# Altium schematic sheet 1XGSH00_MCU.SchDoc
size A3
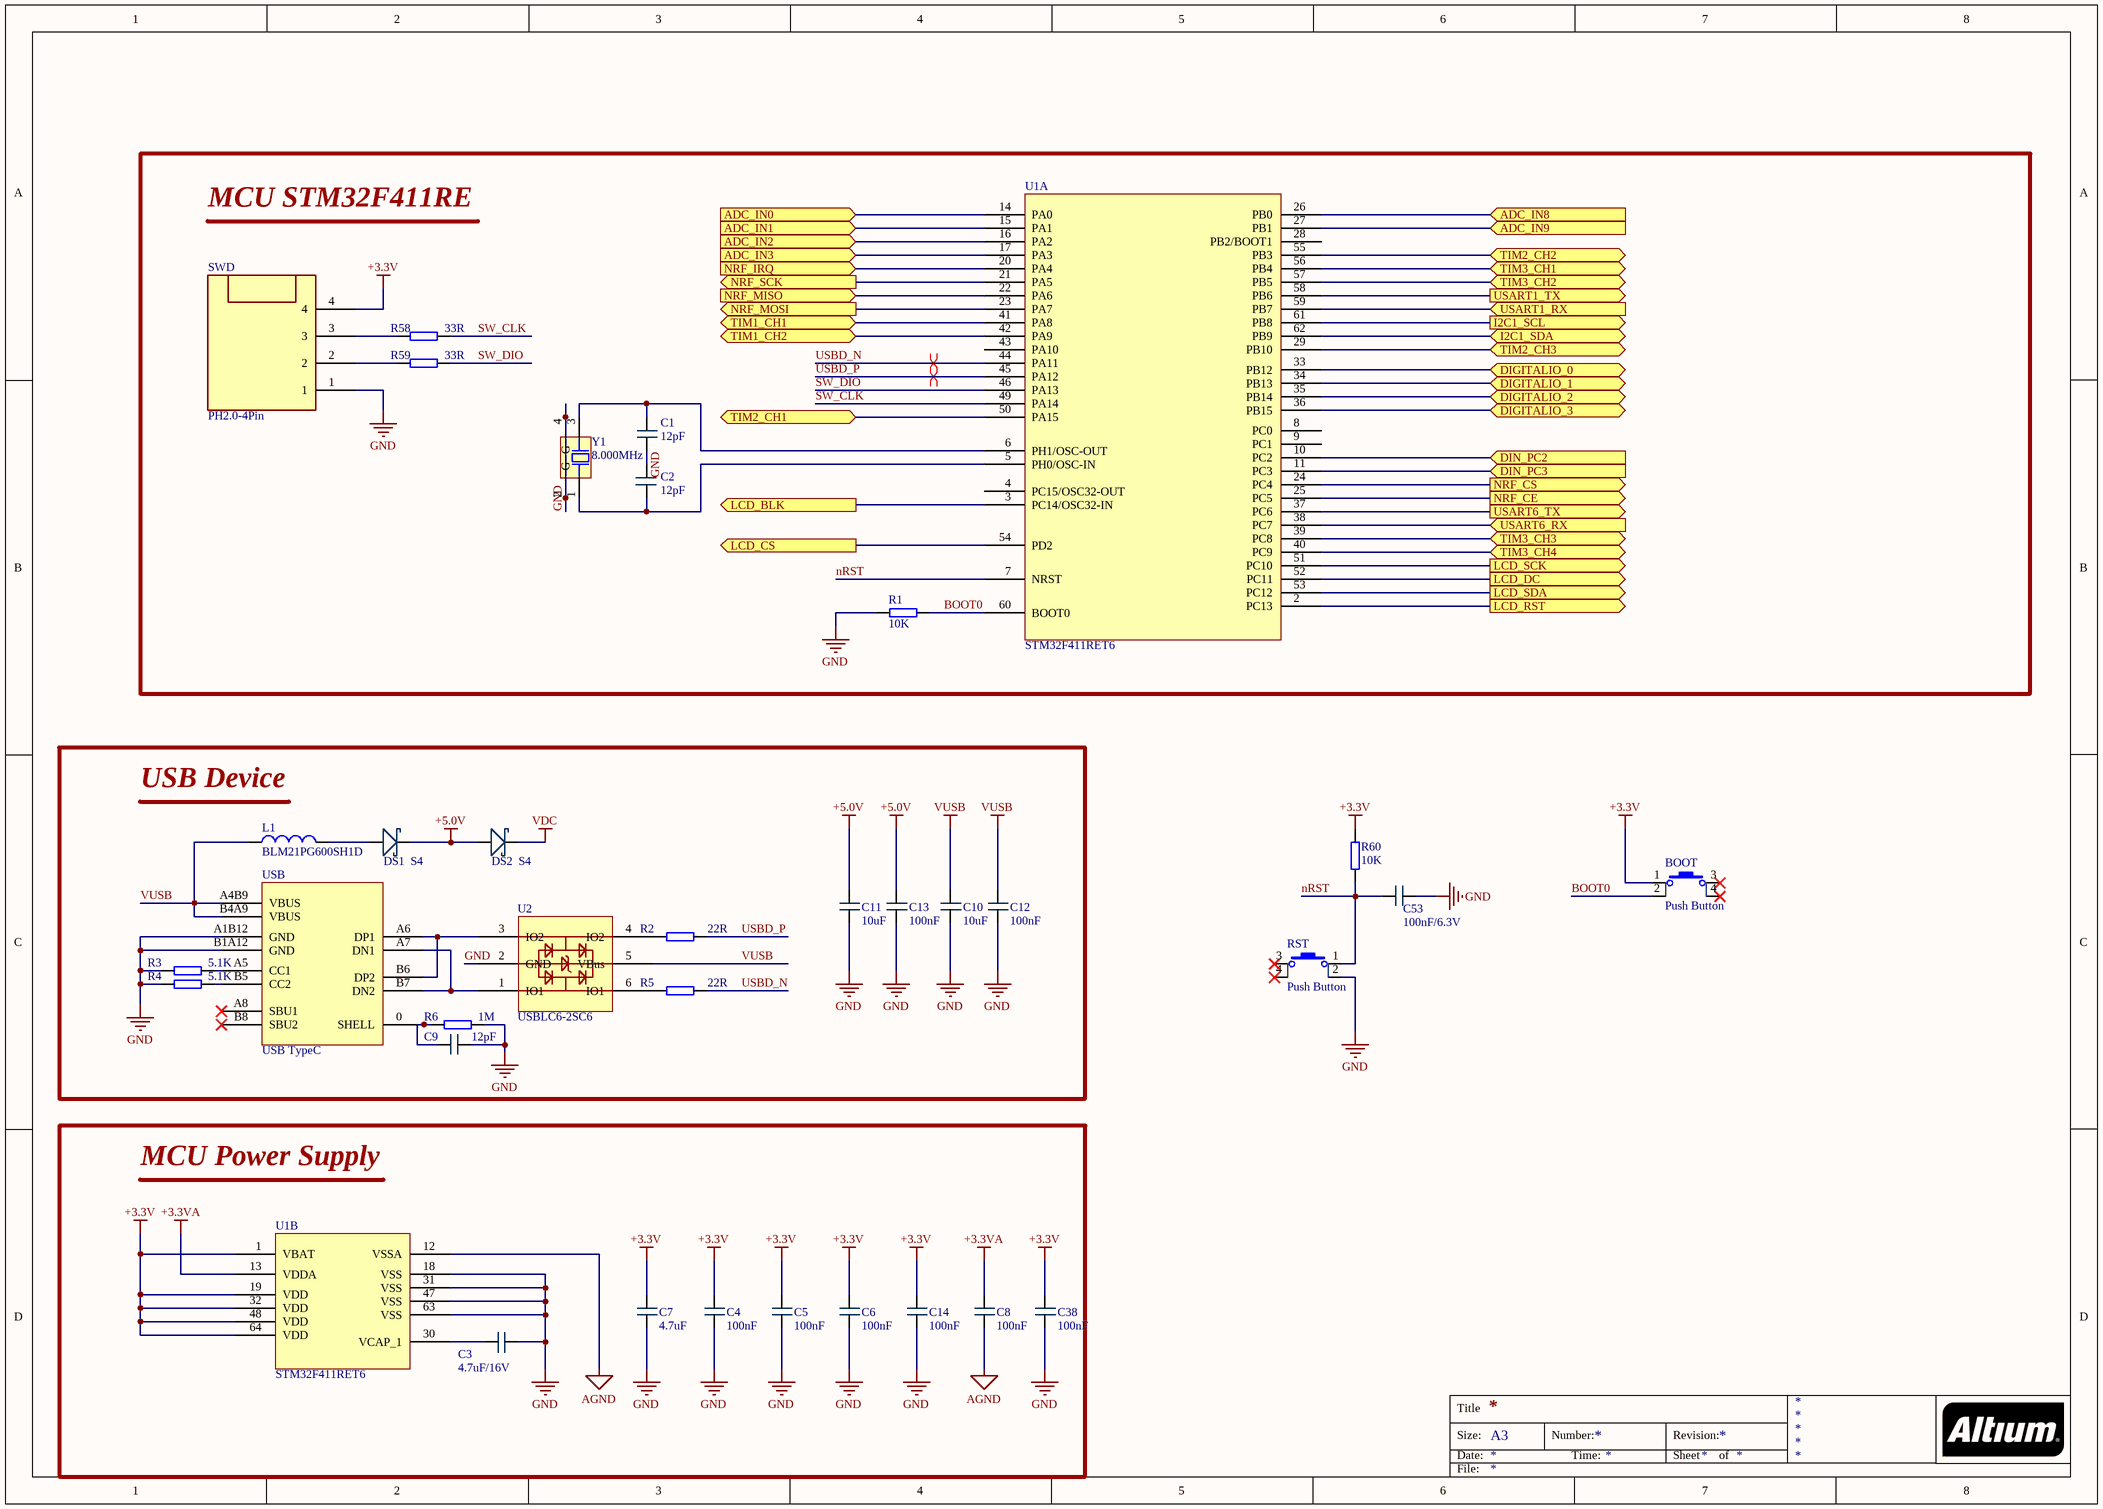
[diagram p0: 1XGSH00_MCU.SchDoc]

## Parts
BOOT  Push Button  [SW-SMD_TS-1010B-B-A]
C1  12pF  [0402_C]
C2  12pF  [0402_C]
C3  4.7uF/16V  [0603_C]
C4  100nF  [0402_C]
C5  100nF  [0402_C]
C6  100nF  [0402_C]
C7  4.7uF  [0603_C]
C8  100nF  [0402_C]
C9  12pF  [0603_C]
C10  10uF  [0603_C]
C11  10uF  [0603_C]
C12  100nF  [0402_C]
C13  100nF  [0402_C]
C14  100nF  [0402_C]
C38  100nF  [0402_C]
C53  100nF/6.3V  [0402_C]
DS1  S4  [SOD-323]
DS2  S4  [SOD-323]
L1  BLM21PG600SH1D  [0805_L]
R1  10K  [0402_R]
R2  22R  [0402_R]
R3  5.1K  [0402_R]
R4  5.1K  [0402_R]
R5  22R  [0402_R]
R6  1M  [0603_R]
R58  33R  [0402_R]
R59  33R  [0402_R]
R60  10K  [0402_R]
RST  Push Button  [SW-SMD_TS-1010B-B-A]
SWD  PH2.0-4Pin  [X1251WRS-04HF-LPSW]
U1  STM32F411RET6  [LQFP-64_10x10x05P]  (parts A,B of 2)
U2  USBLC6-2SC6  [SOT-23-6]
USB  USB TypeC  [USB_TypeC_16Pin (2.0)]
Y1  8.000MHz  [SMD-3225_4P]

## Blocks framed on the sheet
MCU STM32F411RE: C1 C2 R1 R58 R59 SWD U1 Y1
USB Device: C9-C13 DS1 DS2 L1 R2-R6 U2 USB
MCU Power Supply: C3-C8 C14 C38 U1

## Ports
ADC_IN0 (in), ADC_IN1 (in), ADC_IN2 (in), ADC_IN3 (in), ADC_IN8 (in), ADC_IN9 (in), DIGITALIO_0 (bidir), DIGITALIO_1 (bidir), DIGITALIO_2 (bidir), DIGITALIO_3 (bidir), DIN_PC2 (in), DIN_PC3 (in), I2C1_SCL (out), I2C1_SDA (bidir), LCD_BLK (out), LCD_CS (out), LCD_DC (out), LCD_RST (out), LCD_SCK (out), LCD_SDA (out), NRF_CE (out), NRF_CS (out), NRF_IRQ (in), NRF_MISO (in), NRF_MOSI (out), NRF_SCK (out), TIM1_CH1 (bidir), TIM1_CH2 (bidir), TIM2_CH1 (bidir), TIM2_CH2 (bidir), TIM2_CH3 (bidir), TIM3_CH1 (bidir), TIM3_CH2 (bidir), TIM3_CH3 (bidir), TIM3_CH4 (bidir), USART1_RX (in), USART1_TX (out), USART6_RX (in), USART6_TX (out)

## Nets
+3.3V: BOOT.1 C4.2(-) C5.2(-) C6.2(-) C7.2(-) C14.2(-) C38.2(-) R60.1 SWD.4 U1.1(VBAT) U1.19(VDD) U1.32(VDD) U1.48(VDD) U1.64(VDD)
+3.3VA: C8.2(-) U1.13(VDDA)
+5.0V: C11.2(-) C13.2(-) DS1.2(-) DS2.1(-)
AGND: C8.1(-) U1.12(VSSA)
GND: C1.1(-) C2.1(-) C3.2(-) C4.1(-) C5.1(-) C6.1(-) C7.1(-) C9.1(-) C10.1(-) C11.1(-) C12.1(-) C13.1(-) C14.1(-) C38.1(-) C53.1(-) R1.1 R3.1 R4.1 R6.2 RST.2 SWD.1 U1.18(VSS) U1.31(VSS) U1.47(VSS) U1.63(VSS) U2.2(GND) USB.A1B12(GND) USB.B1A12(GND) Y1.2(G) Y1.4(G)
VDC: DS2.2(-)
VUSB: C10.2(-) C12.2(-) L1.1 U2.5(VBus) USB.A4B9(VBUS) USB.B4A9(VBUS)
ADC_IN0: U1.14(PA0) ; port ADC_IN0
ADC_IN1: U1.15(PA1) ; port ADC_IN1
ADC_IN2: U1.16(PA2) ; port ADC_IN2
ADC_IN3: U1.17(PA3) ; port ADC_IN3
ADC_IN8: U1.26(PB0) ; port ADC_IN8
ADC_IN9: U1.27(PB1) ; port ADC_IN9
BOOT0: BOOT.2 R1.2 U1.60(BOOT0)
DIGITALIO_0: U1.33(PB12) ; port DIGITALIO_0
DIGITALIO_1: U1.34(PB13) ; port DIGITALIO_1
DIGITALIO_2: U1.35(PB14) ; port DIGITALIO_2
DIGITALIO_3: U1.36(PB15) ; port DIGITALIO_3
DIN_PC2: U1.10(PC2) ; port DIN_PC2
DIN_PC3: U1.11(PC3) ; port DIN_PC3
I2C1_SCL: U1.61(PB8) ; port I2C1_SCL
I2C1_SDA: U1.62(PB9) ; port I2C1_SDA
LCD_BLK: U1.3(PC14/OSC32-IN) ; port LCD_BLK
LCD_CS: U1.54(PD2) ; port LCD_CS
LCD_DC: U1.52(PC11) ; port LCD_DC
LCD_RST: U1.2(PC13) ; port LCD_RST
LCD_SCK: U1.51(PC10) ; port LCD_SCK
LCD_SDA: U1.53(PC12) ; port LCD_SDA
NRF_CE: U1.25(PC5) ; port NRF_CE
NRF_CS: U1.24(PC4) ; port NRF_CS
NRF_IRQ: U1.20(PA4) ; port NRF_IRQ
NRF_MISO: U1.22(PA6) ; port NRF_MISO
NRF_MOSI: U1.23(PA7) ; port NRF_MOSI
NRF_SCK: U1.21(PA5) ; port NRF_SCK
nRST: C53.2(-) R60.2 RST.1 U1.7(NRST)
SW_CLK: R58.2 U1.49(PA14)
SW_DIO: R59.2 U1.46(PA13)
TIM1_CH1: U1.41(PA8) ; port TIM1_CH1
TIM1_CH2: U1.42(PA9) ; port TIM1_CH2
TIM2_CH1: U1.50(PA15) ; port TIM2_CH1
TIM2_CH2: U1.55(PB3) ; port TIM2_CH2
TIM2_CH3: U1.29(PB10) ; port TIM2_CH3
TIM3_CH1: U1.56(PB4) ; port TIM3_CH1
TIM3_CH2: U1.57(PB5) ; port TIM3_CH2
TIM3_CH3: U1.39(PC8) ; port TIM3_CH3
TIM3_CH4: U1.40(PC9) ; port TIM3_CH4
USART1_RX: U1.59(PB7) ; port USART1_RX
USART1_TX: U1.58(PB6) ; port USART1_TX
USART6_RX: U1.38(PC7) ; port USART6_RX
USART6_TX: U1.37(PC6) ; port USART6_TX
USBD_N: R5.2 U1.44(PA11)
USBD_P: R2.2 U1.45(PA12)
NetC1_2: C1.2(-) U1.6(PH1/OSC-OUT) Y1.3
NetC2_2: C2.2(-) U1.5(PH0/OSC-IN) Y1.1
NetC3_1: C3.1(-) U1.30(VCAP_1)
NetC9_2: C9.2(-) R6.1 USB.0(SHELL)
NetDS1_1: DS1.1(-) L1.2
NetR2_1: R2.1 U2.4(IO2)
NetR3_2: R3.2 USB.A5(CC1)
NetR4_2: R4.2 USB.B5(CC2)
NetR5_1: R5.1 U2.6(IO1)
NetR58_1: R58.1 SWD.3
NetR59_1: R59.1 SWD.2
NetU2_1: U2.1(IO1) USB.A7(DN1) USB.B7(DN2)
NetU2_3: U2.3(IO2) USB.A6(DP1) USB.B6(DP2)

Not connected (* = marked no-connect by the designer): BOOT 3* 4*; RST 3* 4*; U1 4(PC15/OSC32-OUT) 8(PC0) 9(PC1) 28(PB2/BOOT1) 43(PA10); USB A8(SBU1)* B8(SBU2)*

## Layout directives
differential pair: USBD_N, USBD_P

## Notes on the sheet
- Title
- Size:
- Date:
- A3
- Number:
- Time:
- Revision:
- Sheet
- of
- File:

## Library data of the parts
BOOT RST = SW-PB-SPST
C1-C14 C38 C53 = Capacitor
DS1 DS2 = Diode Scotty: Scotty Diode
L1 = Inductor: Code_IEC: 1005; Published: 8-Jun-2000; LatestRevisionDate: 29-May-2009; LatestRevisionNote: IPC-7351 Footprint Added.; PackageReference: 0402-A; Publisher: Altium Limited; PackageDescription: Chip Inductor; Code_JEITA: 0402
R1-R6 R58-R60 = Resistor: Value: 1K
U1 = STM32F411RET6: STM32 Series MCU
USB = USB TypeC 16Pin
Y1 = XTAL_SMD